# Altium schematic sheet RedBaron v2.SchDoc
size 1524 x 762 mm; SheetNumber: 1; SheetTotal: 1
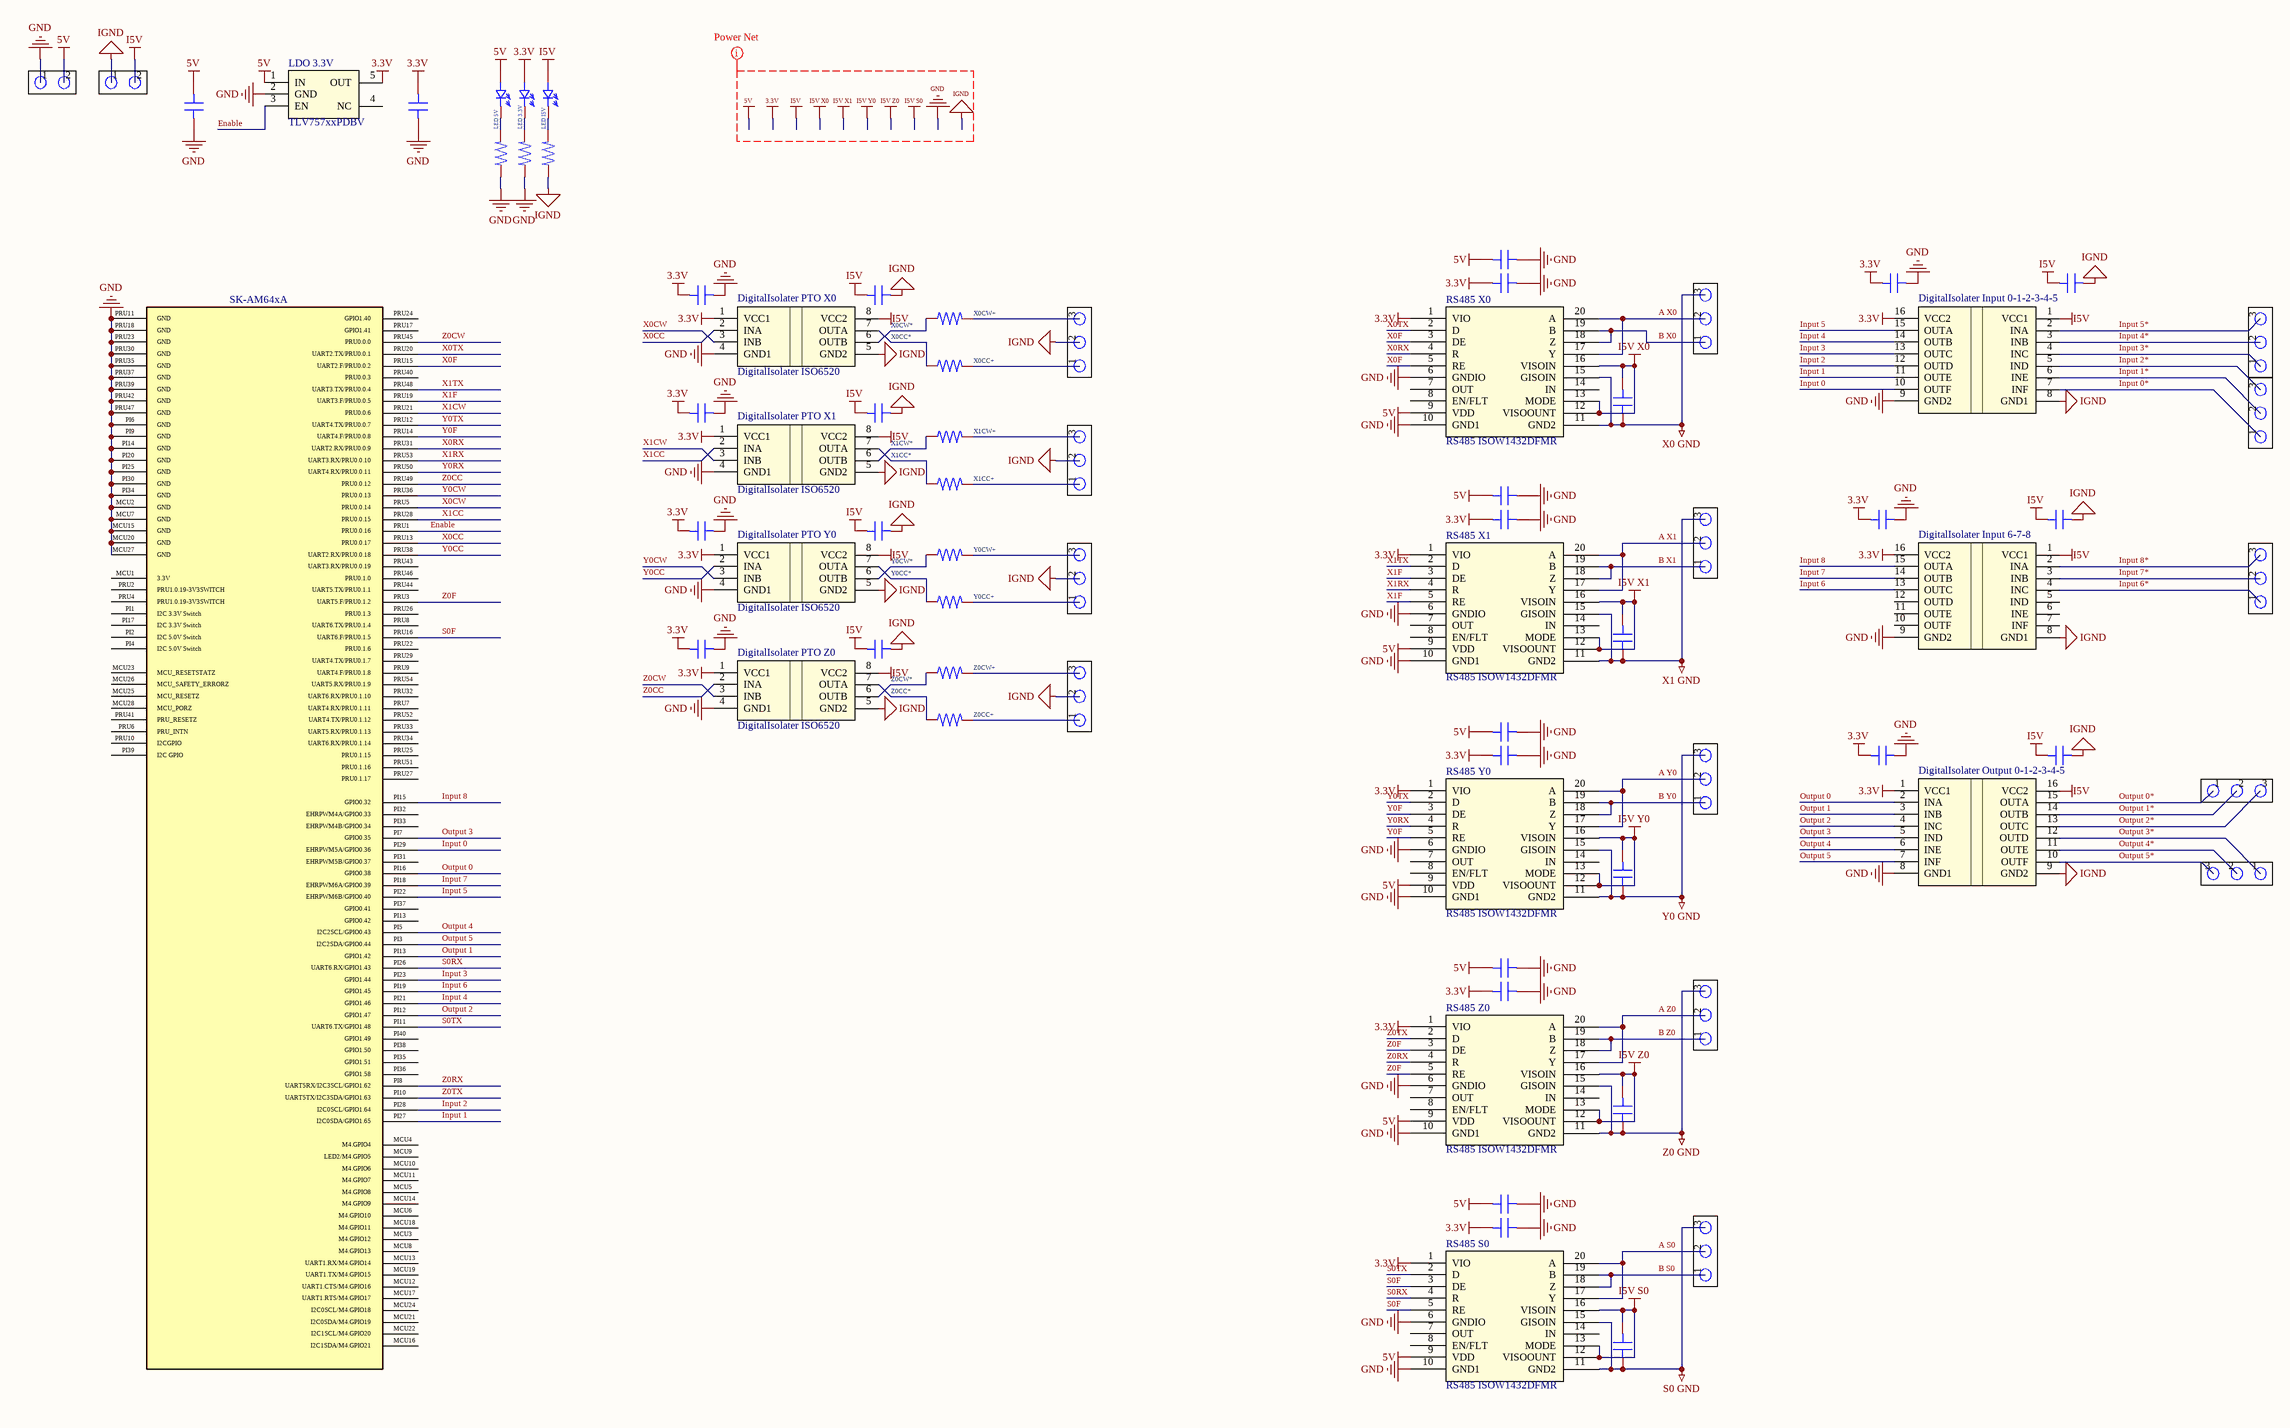
[diagram p0: RedBaron v2.SchDoc]

## Parts
C_Input_0-1-2-3-4-5_3.3V  1uF  [Capacitor 2012(0805)]  (value not drawn)
C_Input_0-1-2-3-4-5_I5V  1uF  [Capacitor 2012(0805)]  (value not drawn)
C_Input_6-7-8_3.3V  1uF  [Capacitor 2012(0805)]  (value not drawn)
C_Input_6-7-8_I5V  1uF  [Capacitor 2012(0805)]  (value not drawn)
C_LDO3.3V_IN  47uF  [Capacitor 2012(0805)]  (value not drawn)
C_LDO3.3V_OUT  47uF  [Capacitor 2012(0805)]  (value not drawn)
C_Output_0-1-2-3-4-5_3.3V  1uF  [Capacitor 2012(0805)]  (value not drawn)
C_Output_0-1-2-3-4-5_I5V  1uF  [Capacitor 2012(0805)]  (value not drawn)
C_PTO_X0_3.3V  1uF  [Capacitor 2012(0805)]  (value not drawn)
C_PTO_X0_I5V  1uF  [Capacitor 2012(0805)]  (value not drawn)
C_PTO_X1_3.3V  1uF  [Capacitor 2012(0805)]  (value not drawn)
C_PTO_X1_I5V  1uF  [Capacitor 2012(0805)]  (value not drawn)
C_PTO_Y0_3.3V  1uF  [Capacitor 2012(0805)]  (value not drawn)
C_PTO_Y0_I5V  1uF  [Capacitor 2012(0805)]  (value not drawn)
C_PTO_Z0_3.3V  1uF  [Capacitor 2012(0805)]  (value not drawn)
C_PTO_Z0_I5V  1uF  [Capacitor 2012(0805)]  (value not drawn)
C_RS485_C1_I5V  1uF  [Capacitor 2012(0805)]  (value not drawn)
C_RS485_S0_3.3V  1uF  [Capacitor 2012(0805)]  (value not drawn)
C_RS485_S0_5V  1uF  [Capacitor 2012(0805)]  (value not drawn)
C_RS485_S0_I5V  1uF  [Capacitor 2012(0805)]  (value not drawn)
C_RS485_X0_3.3V  1uF  [Capacitor 2012(0805)]  (value not drawn)
C_RS485_X0_5V  1uF  [Capacitor 2012(0805)]  (value not drawn)
C_RS485_X0_I5V  1uF  [Capacitor 2012(0805)]  (value not drawn)
C_RS485_X1_3.3V  1uF  [Capacitor 2012(0805)]  (value not drawn)
C_RS485_X1_5V  1uF  [Capacitor 2012(0805)]  (value not drawn)
C_RS485_Y0_3.3V  1uF  [Capacitor 2012(0805)]  (value not drawn)
C_RS485_Y0_5V  1uF  [Capacitor 2012(0805)]  (value not drawn)
C_RS485_Y0_I5V  1uF  [Capacitor 2012(0805)]  (value not drawn)
C_RS485_Z0_3.3V  1uF  [Capacitor 2012(0805)]  (value not drawn)
C_RS485_Z0_5V  1uF  [Capacitor 2012(0805)]  (value not drawn)
C_RS485_Z0_I5V  1uF  [Capacitor 2012(0805)]  (value not drawn)
Connector_DigitalPower  Connector Terminal Screw 5.08mm 2pin  [Terminal Screw 5.08mm 2pin]  (value not drawn)
Connector_Input_0-1-2  Connector Terminal Screw 5.08mm 3pin  [Terminal Screw 5.08mm 3pin]  (value not drawn)
Connector_Input_3-4-5  Connector Terminal Screw 5.08mm 3pin  [Terminal Screw 5.08mm 3pin]  (value not drawn)
Connector_Input_6-7-8  Connector Terminal Screw 5.08mm 3pin  [Terminal Screw 5.08mm 3pin]  (value not drawn)
Connector_IsolatedPower  Connector Terminal Screw 5.08mm 2pin  [Terminal Screw 5.08mm 2pin]  (value not drawn)
Connector_Output_0-1-2  Connector Terminal Screw 5.08mm 3pin  [Terminal Screw 5.08mm 3pin]  (value not drawn)
Connector_Output_3-4-5  Connector Terminal Screw 5.08mm 3pin  [Terminal Screw 5.08mm 3pin]  (value not drawn)
Connector_PTO_X0  Connector Terminal Screw 5.08mm 3pin  [Terminal Screw 5.08mm 3pin]  (value not drawn)
Connector_PTO_X1  Connector Terminal Screw 5.08mm 3pin  [Terminal Screw 5.08mm 3pin]  (value not drawn)
Connector_PTO_Y0  Connector Terminal Screw 5.08mm 3pin  [Terminal Screw 5.08mm 3pin]  (value not drawn)
Connector_PTO_Z0  Connector Terminal Screw 5.08mm 3pin  [Terminal Screw 5.08mm 3pin]  (value not drawn)
Connector_RS485_S0  Connector Terminal Screw 5.08mm 3pin  [Terminal Screw 5.08mm 3pin]  (value not drawn)
Connector_RS485_X0  Connector Terminal Screw 5.08mm 3pin  [Terminal Screw 5.08mm 3pin]  (value not drawn)
Connector_RS485_X1  Connector Terminal Screw 5.08mm 3pin  [Terminal Screw 5.08mm 3pin]  (value not drawn)
Connector_RS485_Y0  Connector Terminal Screw 5.08mm 3pin  [Terminal Screw 5.08mm 3pin]  (value not drawn)
Connector_RS485_Z0  Connector Terminal Screw 5.08mm 3pin  [Terminal Screw 5.08mm 3pin]  (value not drawn)
DevBoard  SK-AM64xA  [DevBoard SKAM64XA]
DigitalIsolater_Input_0-1-2-3-4-5  DigitalIsolater ISO7760  [ISO7760DBQ]  (value not drawn)
DigitalIsolater_Input_6-7-8  DigitalIsolater ISO7760  [ISO7760DBQ]  (value not drawn)
DigitalIsolater_Output_0-1-2-3-4-5  DigitalIsolater ISO7760  [ISO7760DBQ]  (value not drawn)
DigitalIsolater_PTO_X0  DigitalIsolater ISO6520  [ISO6520D]
DigitalIsolater_PTO_X1  DigitalIsolater ISO6520  [ISO6520D]
DigitalIsolater_PTO_Y0  DigitalIsolater ISO6520  [ISO6520D]
DigitalIsolater_PTO_Z0  DigitalIsolater ISO6520  [ISO6520D]
LDO_3.3V  TLV757xxPDBV  [TLV757xxPDBV]
LED_3.3V  LED  [LED 2012(0805)]  (value not drawn)
LED_5V  LED  [LED 2012(0805)]  (value not drawn)
LED_I5V  LED  [LED 2012(0805)]  (value not drawn)
R_LED_3.3V  150E  [Resistor 2012(0805)]  (value not drawn)
R_LED_5V  150E  [Resistor 2012(0805)]  (value not drawn)
R_LED_I5V  150E  [Resistor 2012(0805)]  (value not drawn)
R_X0CC  270E  [Resistor 2012(0805)]  (value not drawn)
R_X0CW  270E  [Resistor 2012(0805)]  (value not drawn)
R_X1CC  270E  [Resistor 2012(0805)]  (value not drawn)
R_X1CW  270E  [Resistor 2012(0805)]  (value not drawn)
R_Y0CC  270E  [Resistor 2012(0805)]  (value not drawn)
R_Y0CW  270E  [Resistor 2012(0805)]  (value not drawn)
R_Z0CC  270E  [Resistor 2012(0805)]  (value not drawn)
R_Z0CW  270E  [Resistor 2012(0805)]  (value not drawn)
RS485_S0  RS485 ISOW1432DFMR  [XISOW1432DFMR]
RS485_X0  RS485 ISOW1432DFMR  [XISOW1432DFMR]
RS485_X1  RS485 ISOW1432DFMR  [XISOW1432DFMR]
RS485_Y0  RS485 ISOW1432DFMR  [XISOW1432DFMR]
RS485_Z0  RS485 ISOW1432DFMR  [XISOW1432DFMR]

## Nets
3.3V: C_Input_0-1-2-3-4-5_3.3V.2 C_Input_6-7-8_3.3V.2 C_LDO3.3V_OUT.2 C_Output_0-1-2-3-4-5_3.3V.2 C_PTO_X0_3.3V.2 C_PTO_X1_3.3V.2 C_PTO_Y0_3.3V.2 C_PTO_Z0_3.3V.2 C_RS485_S0_3.3V.2 C_RS485_X0_3.3V.2 C_RS485_X1_3.3V.2 C_RS485_Y0_3.3V.2 C_RS485_Z0_3.3V.2 DigitalIsolater_Input_0-1-2-3-4-5.16(VCC2) DigitalIsolater_Input_6-7-8.16(VCC2) DigitalIsolater_Output_0-1-2-3-4-5.1(VCC1) DigitalIsolater_PTO_X0.1(VCC1) DigitalIsolater_PTO_X1.1(VCC1) DigitalIsolater_PTO_Y0.1(VCC1) DigitalIsolater_PTO_Z0.1(VCC1) LDO_3.3V.5(OUT) LED_3.3V.1 RS485_S0.1(VIO) RS485_X0.1(VIO) RS485_X1.1(VIO) RS485_Y0.1(VIO) RS485_Z0.1(VIO)
5V: C_LDO3.3V_IN.2 C_RS485_S0_5V.2 C_RS485_X0_5V.2 C_RS485_X1_5V.2 C_RS485_Y0_5V.2 C_RS485_Z0_5V.2 Connector_DigitalPower.2 LDO_3.3V.1(IN) LED_5V.1 RS485_S0.9(VDD) RS485_X0.9(VDD) RS485_X1.9(VDD) RS485_Y0.9(VDD) RS485_Z0.9(VDD)
GND: C_Input_0-1-2-3-4-5_3.3V.1 C_Input_6-7-8_3.3V.1 C_LDO3.3V_IN.1 C_LDO3.3V_OUT.1 C_Output_0-1-2-3-4-5_3.3V.1 C_PTO_X0_3.3V.1 C_PTO_X1_3.3V.1 C_PTO_Y0_3.3V.1 C_PTO_Z0_3.3V.1 C_RS485_S0_3.3V.1 C_RS485_S0_5V.1 C_RS485_X0_3.3V.1 C_RS485_X0_5V.1 C_RS485_X1_3.3V.1 C_RS485_X1_5V.1 C_RS485_Y0_3.3V.1 C_RS485_Y0_5V.1 C_RS485_Z0_3.3V.1 C_RS485_Z0_5V.1 Connector_DigitalPower.1 DevBoard.MCU2(GND) DevBoard.MCU7(GND) DevBoard.MCU15(GND) DevBoard.MCU20(GND) DevBoard.MCU27(GND) DevBoard.PI6(GND) DevBoard.PI9(GND) DevBoard.PI14(GND) DevBoard.PI20(GND) DevBoard.PI25(GND) DevBoard.PI30(GND) DevBoard.PI34(GND) DevBoard.PRU11(GND) DevBoard.PRU18(GND) DevBoard.PRU23(GND) DevBoard.PRU30(GND) DevBoard.PRU35(GND) DevBoard.PRU37(GND) DevBoard.PRU39(GND) DevBoard.PRU42(GND) DevBoard.PRU47(GND) DigitalIsolater_Input_0-1-2-3-4-5.9(GND2) DigitalIsolater_Input_6-7-8.9(GND2) DigitalIsolater_Output_0-1-2-3-4-5.8(GND1) DigitalIsolater_PTO_X0.4(GND1) DigitalIsolater_PTO_X1.4(GND1) DigitalIsolater_PTO_Y0.4(GND1) DigitalIsolater_PTO_Z0.4(GND1) LDO_3.3V.2(GND) R_LED_3.3V.1 R_LED_5V.1 RS485_S0.6(GNDIO) RS485_S0.10(GND1) RS485_X0.6(GNDIO) RS485_X0.10(GND1) RS485_X1.6(GNDIO) RS485_X1.10(GND1) RS485_Y0.6(GNDIO) RS485_Y0.10(GND1) RS485_Z0.6(GNDIO) RS485_Z0.10(GND1)
I5V: C_Input_0-1-2-3-4-5_I5V.2 C_Input_6-7-8_I5V.2 C_Output_0-1-2-3-4-5_I5V.2 C_PTO_X0_I5V.2 C_PTO_X1_I5V.2 C_PTO_Y0_I5V.2 C_PTO_Z0_I5V.2 Connector_IsolatedPower.2 DigitalIsolater_Input_0-1-2-3-4-5.1(VCC1) DigitalIsolater_Input_6-7-8.1(VCC1) DigitalIsolater_Output_0-1-2-3-4-5.16(VCC2) DigitalIsolater_PTO_X0.8(VCC2) DigitalIsolater_PTO_X1.8(VCC2) DigitalIsolater_PTO_Y0.8(VCC2) DigitalIsolater_PTO_Z0.8(VCC2) LED_I5V.1
I5V S0: C_RS485_S0_I5V.2 RS485_S0.12(VISOOUNT) RS485_S0.13(MODE) RS485_S0.16(VISOIN)
I5V X0: C_RS485_X0_I5V.2 RS485_X0.12(VISOOUNT) RS485_X0.13(MODE) RS485_X0.16(VISOIN)
I5V X1: C_RS485_C1_I5V.2 RS485_X1.12(VISOOUNT) RS485_X1.13(MODE) RS485_X1.16(VISOIN)
I5V Y0: C_RS485_Y0_I5V.2 RS485_Y0.12(VISOOUNT) RS485_Y0.13(MODE) RS485_Y0.16(VISOIN)
I5V Z0: C_RS485_Z0_I5V.2 RS485_Z0.12(VISOOUNT) RS485_Z0.13(MODE) RS485_Z0.16(VISOIN)
IGND: C_Input_0-1-2-3-4-5_I5V.1 C_Input_6-7-8_I5V.1 C_Output_0-1-2-3-4-5_I5V.1 C_PTO_X0_I5V.1 C_PTO_X1_I5V.1 C_PTO_Y0_I5V.1 C_PTO_Z0_I5V.1 Connector_IsolatedPower.1 Connector_PTO_X0.2 Connector_PTO_X1.2 Connector_PTO_Y0.2 Connector_PTO_Z0.2 DigitalIsolater_Input_0-1-2-3-4-5.8(GND1) DigitalIsolater_Input_6-7-8.8(GND1) DigitalIsolater_Output_0-1-2-3-4-5.9(GND2) DigitalIsolater_PTO_X0.5(GND2) DigitalIsolater_PTO_X1.5(GND2) DigitalIsolater_PTO_Y0.5(GND2) DigitalIsolater_PTO_Z0.5(GND2) R_LED_I5V.1
S0 GND: C_RS485_S0_I5V.1 Connector_RS485_S0.3 RS485_S0.11(GND2) RS485_S0.15(GISOIN)
X0 GND: C_RS485_X0_I5V.1 Connector_RS485_X0.3 RS485_X0.11(GND2) RS485_X0.15(GISOIN)
X1 GND: C_RS485_C1_I5V.1 Connector_RS485_X1.3 RS485_X1.11(GND2) RS485_X1.15(GISOIN)
Y0 GND: C_RS485_Y0_I5V.1 Connector_RS485_Y0.3 RS485_Y0.11(GND2) RS485_Y0.15(GISOIN)
Z0 GND: C_RS485_Z0_I5V.1 Connector_RS485_Z0.3 RS485_Z0.11(GND2) RS485_Z0.15(GISOIN)
A S0: Connector_RS485_S0.2 RS485_S0.17(Y) RS485_S0.20(A)
A X0: Connector_RS485_X0.2 RS485_X0.17(Y) RS485_X0.20(A)
A X1: Connector_RS485_X1.2 RS485_X1.17(Y) RS485_X1.20(A)
A Y0: Connector_RS485_Y0.2 RS485_Y0.17(Y) RS485_Y0.20(A)
A Z0: Connector_RS485_Z0.2 RS485_Z0.17(Y) RS485_Z0.20(A)
B S0: Connector_RS485_S0.1 RS485_S0.18(Z) RS485_S0.19(B)
B X0: Connector_RS485_X0.1 RS485_X0.18(Z) RS485_X0.19(B)
B X1: Connector_RS485_X1.1 RS485_X1.18(Z) RS485_X1.19(B)
B Y0: Connector_RS485_Y0.1 RS485_Y0.18(Z) RS485_Y0.19(B)
B Z0: Connector_RS485_Z0.1 RS485_Z0.18(Z) RS485_Z0.19(B)
Enable: DevBoard.PRU1(PRU0.0.16) LDO_3.3V.3(EN)
Input 0: DevBoard.PI29(EHRPWM5A/GPIO0.36) DigitalIsolater_Input_0-1-2-3-4-5.10(OUTF)
Input 0*: Connector_Input_0-1-2.1 DigitalIsolater_Input_0-1-2-3-4-5.7(INF)
Input 1: DevBoard.PI27(I2C0SDA/GPIO1.65) DigitalIsolater_Input_0-1-2-3-4-5.11(OUTE)
Input 1*: Connector_Input_0-1-2.2 DigitalIsolater_Input_0-1-2-3-4-5.6(INE)
Input 2: DevBoard.PI28(I2C0SCL/GPIO1.64) DigitalIsolater_Input_0-1-2-3-4-5.12(OUTD)
Input 2*: Connector_Input_0-1-2.3 DigitalIsolater_Input_0-1-2-3-4-5.5(IND)
Input 3: DevBoard.PI23(GPIO1.44) DigitalIsolater_Input_0-1-2-3-4-5.13(OUTC)
Input 3*: Connector_Input_3-4-5.1 DigitalIsolater_Input_0-1-2-3-4-5.4(INC)
Input 4: DevBoard.PI21(GPIO1.46) DigitalIsolater_Input_0-1-2-3-4-5.14(OUTB)
Input 4*: Connector_Input_3-4-5.2 DigitalIsolater_Input_0-1-2-3-4-5.3(INB)
Input 5: DevBoard.PI22(EHRPWM6B/GPIO0.40) DigitalIsolater_Input_0-1-2-3-4-5.15(OUTA)
Input 5*: Connector_Input_3-4-5.3 DigitalIsolater_Input_0-1-2-3-4-5.2(INA)
Input 6: DevBoard.PI19(GPIO1.45) DigitalIsolater_Input_6-7-8.13(OUTC)
Input 6*: Connector_Input_6-7-8.1 DigitalIsolater_Input_6-7-8.4(INC)
Input 7: DevBoard.PI18(EHRPWM6A/GPIO0.39) DigitalIsolater_Input_6-7-8.14(OUTB)
Input 7*: Connector_Input_6-7-8.2 DigitalIsolater_Input_6-7-8.3(INB)
Input 8: DevBoard.PI15(GPIO0.32) DigitalIsolater_Input_6-7-8.15(OUTA)
Input 8*: Connector_Input_6-7-8.3 DigitalIsolater_Input_6-7-8.2(INA)
LED 3.3V: LED_3.3V.2 R_LED_3.3V.2
LED 5V: LED_5V.2 R_LED_5V.2
LED I5V: LED_I5V.2 R_LED_I5V.2
Output 0: DevBoard.PI16(GPIO0.38) DigitalIsolater_Output_0-1-2-3-4-5.2(INA)
Output 0*: Connector_Output_0-1-2.1 DigitalIsolater_Output_0-1-2-3-4-5.15(OUTA)
Output 1: DevBoard.PI13(GPIO0.42) DigitalIsolater_Output_0-1-2-3-4-5.3(INB)
Output 1*: Connector_Output_0-1-2.2 DigitalIsolater_Output_0-1-2-3-4-5.14(OUTB)
Output 2: DevBoard.PI12(GPIO1.47) DigitalIsolater_Output_0-1-2-3-4-5.4(INC)
Output 2*: Connector_Output_0-1-2.3 DigitalIsolater_Output_0-1-2-3-4-5.13(OUTC)
Output 3: DevBoard.PI7(GPIO0.35) DigitalIsolater_Output_0-1-2-3-4-5.5(IND)
Output 3*: Connector_Output_3-4-5.1 DigitalIsolater_Output_0-1-2-3-4-5.12(OUTD)
Output 4: DevBoard.PI5(I2C2SCL/GPIO0.43) DigitalIsolater_Output_0-1-2-3-4-5.6(INE)
Output 4*: Connector_Output_3-4-5.2 DigitalIsolater_Output_0-1-2-3-4-5.11(OUTE)
Output 5: DevBoard.PI3(I2C2SDA/GPIO0.44) DigitalIsolater_Output_0-1-2-3-4-5.7(INF)
Output 5*: Connector_Output_3-4-5.3 DigitalIsolater_Output_0-1-2-3-4-5.10(OUTF)
S0F: DevBoard.PRU16(UART6.F/PRU0.1.5) RS485_S0.3(DE) RS485_S0.5(RE)
S0RX: DevBoard.PI26(UART6.RX/GPIO1.43) RS485_S0.4(R)
S0TX: DevBoard.PI11(UART6.TX/GPIO1.48) RS485_S0.2(D)
X0CC: DevBoard.PRU13(PRU0.0.17) DigitalIsolater_PTO_X0.2(INA)
X0CC*: DigitalIsolater_PTO_X0.7(OUTA) R_X0CC.1
X0CC+: Connector_PTO_X0.1 R_X0CC.2
X0CW: DevBoard.PRU5(PRU0.0.14) DigitalIsolater_PTO_X0.3(INB)
X0CW*: DigitalIsolater_PTO_X0.6(OUTB) R_X0CW.1
X0CW+: Connector_PTO_X0.3 R_X0CW.2
X0F: DevBoard.PRU15(UART2.F/PRU0.0.2) RS485_X0.3(DE) RS485_X0.5(RE)
X0RX: DevBoard.PRU31(UART2.RX/PRU0.0.9) RS485_X0.4(R)
X0TX: DevBoard.PRU20(UART2.TX/PRU0.0.1) RS485_X0.2(D)
X1CC: DevBoard.PRU28(PRU0.0.15) DigitalIsolater_PTO_X1.2(INA)
X1CC*: DigitalIsolater_PTO_X1.7(OUTA) R_X1CC.1
X1CC+: Connector_PTO_X1.1 R_X1CC.2
X1CW: DevBoard.PRU21(PRU0.0.6) DigitalIsolater_PTO_X1.3(INB)
X1CW*: DigitalIsolater_PTO_X1.6(OUTB) R_X1CW.1
X1CW+: Connector_PTO_X1.3 R_X1CW.2
X1F: DevBoard.PRU19(UART3.F/PRU0.0.5) RS485_X1.3(DE) RS485_X1.5(RE)
X1RX: DevBoard.PRU53(UART3.RX/PRU0.0.10) RS485_X1.4(R)
X1TX: DevBoard.PRU48(UART3.TX/PRU0.0.4) RS485_X1.2(D)
Y0CC: DevBoard.PRU38(UART2.RX/PRU0.0.18) DigitalIsolater_PTO_Y0.2(INA)
Y0CC*: DigitalIsolater_PTO_Y0.7(OUTA) R_Y0CC.1
Y0CC+: Connector_PTO_Y0.1 R_Y0CC.2
Y0CW: DevBoard.PRU36(PRU0.0.13) DigitalIsolater_PTO_Y0.3(INB)
Y0CW*: DigitalIsolater_PTO_Y0.6(OUTB) R_Y0CW.1
Y0CW+: Connector_PTO_Y0.3 R_Y0CW.2
Y0F: DevBoard.PRU14(UART4.F/PRU0.0.8) RS485_Y0.3(DE) RS485_Y0.5(RE)
Y0RX: DevBoard.PRU50(UART4.RX/PRU0.0.11) RS485_Y0.4(R)
Y0TX: DevBoard.PRU12(UART4.TX/PRU0.0.7) RS485_Y0.2(D)
Z0CC: DevBoard.PRU49(PRU0.0.12) DigitalIsolater_PTO_Z0.2(INA)
Z0CC*: DigitalIsolater_PTO_Z0.7(OUTA) R_Z0CC.1
Z0CC+: Connector_PTO_Z0.1 R_Z0CC.2
Z0CW: DevBoard.PRU45(PRU0.0.0) DigitalIsolater_PTO_Z0.3(INB)
Z0CW*: DigitalIsolater_PTO_Z0.6(OUTB) R_Z0CW.1
Z0CW+: Connector_PTO_Z0.3 R_Z0CW.2
Z0F: DevBoard.PRU3(UART5.F/PRU0.1.2) RS485_Z0.3(DE) RS485_Z0.5(RE)
Z0RX: DevBoard.PI8(UART5RX/I2C3SCL/GPIO1.62) RS485_Z0.4(R)
Z0TX: DevBoard.PI10(UART5TX/I2C3SDA/GPIO1.63) RS485_Z0.2(D)

Not connected (* = marked no-connect by the designer): DevBoard MCU1(3.3V) MCU3(M4.GPIO12) MCU4(M4.GPIO4) MCU5(M4.GPIO8) MCU6(M4.GPIO10) MCU8(M4.GPIO13) MCU9(LED2/M4.GPIO5) MCU10(M4.GPIO6) MCU11(M4.GPIO7) MCU12(UART1.CTS/M4.GPIO16) MCU13(UART1.RX/M4.GPIO14) MCU14(M4.GPIO9) MCU16(I2C1SDA/M4.GPIO21) MCU17(UART1.RTS/M4.GPIO17) MCU18(M4.GPIO11) MCU19(UART1.TX/M4.GPIO15) MCU21(I2C0SDA/M4.GPIO19) MCU22(I2C1SCL/M4.GPIO20) MCU23(MCU_RESETSTATZ) MCU24(I2C0SCL/M4.GPIO18) MCU25(MCU_RESETZ) MCU26(MCU_SAFETY_ERRORZ) MCU28(MCU_PORZ) PI1(I2C_3.3V_Switch) PI2(I2C_5.0V_Switch) PI4(I2C_5.0V_Switch) PI17(I2C_3.3V_Switch) PI31(EHRPWM5B/GPIO0.37) PI32(EHRPWM4A/GPIO0.33) PI33(EHRPWM4B/GPIO0.34) PI35(GPIO1.51) PI36(GPIO1.58) PI37(GPIO0.41) PI38(GPIO1.50) PI39(I2C_GPIO) PI40(GPIO1.49) PRU2(PRU1.0.19-3V3SWITCH) PRU4(PRU1.0.19-3V3SWITCH) PRU6(PRU_INTN) PRU7(UART4.RX/PRU0.1.11) PRU8(UART6.TX/PRU0.1.4) PRU9(UART4.F/PRU0.1.8) PRU10(I2CGPIO) PRU17(GPIO1.41) PRU22(PRU0.1.6) PRU24(GPIO1.40) PRU25(PRU0.1.15) PRU26(PRU0.1.3) PRU27(PRU0.1.17) PRU29(UART4.TX/PRU0.1.7) PRU32(UART6.RX/PRU0.1.10) PRU33(UART5.RX/PRU0.1.13) PRU34(UART6.RX/PRU0.1.14) PRU40(PRU0.0.3) PRU41(PRU_RESETZ) PRU43(UART3.RX/PRU0.0.19) PRU44(UART5.TX/PRU0.1.1) PRU46(PRU0.1.0) PRU51(PRU0.1.16) PRU52(UART4.TX/PRU0.1.12) PRU54(UART5.RX/PRU0.1.9); DigitalIsolater_Input_6-7-8 5(IND) 6(INE) 7(INF) 10(OUTF) 11(OUTE) 12(OUTD); LDO_3.3V 4(NC); RS485_S0 7(OUT) 8(EN/FLT) 14(IN); RS485_X0 7(OUT) 8(EN/FLT) 14(IN); RS485_X1 7(OUT) 8(EN/FLT) 14(IN); RS485_Y0 7(OUT) 8(EN/FLT) 14(IN); RS485_Z0 7(OUT) 8(EN/FLT) 14(IN)

## Layout directives
net class Power: 3.3V, 5V, GND, I5V, I5V S0, I5V X0, I5V X1, I5V Y0, I5V Z0, IGND

## Library data of the parts
C_Input_0-1-2-3-4-5_3.3V C_Input_0-1-2-3-4-5_I5V C_Input_6-7-8_3.3V C_Input_6-7-8_I5V C_LDO3.3V_IN C_LDO3.3V_OUT C_Output_0-1-2-3-4-5_3.3V C_Output_0-1-2-3-4-5_I5V C_PTO_X0_3.3V C_PTO_X0_I5V C_PTO_X1_3.3V C_PTO_X1_I5V C_PTO_Y0_3.3V C_PTO_Y0_I5V C_PTO_Z0_3.3V C_PTO_Z0_I5V C_RS485_C1_I5V C_RS485_S0_3.3V C_RS485_S0_5V C_RS485_S0_I5V C_RS485_X0_3.3V C_RS485_X0_5V C_RS485_X0_I5V C_RS485_X1_3.3V C_RS485_X1_5V C_RS485_Y0_3.3V C_RS485_Y0_5V C_RS485_Y0_I5V C_RS485_Z0_3.3V C_RS485_Z0_5V C_RS485_Z0_I5V = Capacitor
Connector_DigitalPower Connector_IsolatedPower = Connector Terminal Screw 5.08mm 2pin: Terminal Screw 5.08mm; GateName_1: G$1; SymbolName_1: TERMINALBLOCK1X2; DeviceSetName: TERMINALBLOCK-1X2; LibraryName: TOTUDU; Package: SCREWTERMINAL1X2
Connector_Input_0-1-2 Connector_Input_3-4-5 Connector_Input_6-7-8 Connector_Output_0-1-2 Connector_Output_3-4-5 Connector_PTO_X0 Connector_PTO_X1 Connector_PTO_Y0 Connector_PTO_Z0 Connector_RS485_S0 Connector_RS485_X0 Connector_RS485_X1 Connector_RS485_Y0 Connector_RS485_Z0 = Connector Terminal Screw 5.08mm 3pin: Terminal Screw 5.08mm; GateName_1: G$1; SymbolName_1: TERMINALBLOCK1X2; DeviceSetName: TERMINALBLOCK-1X2; LibraryName: TOTUDU; Package: SCREWTERMINAL1X2
DevBoard = DevBoard SK-AM64xA
DigitalIsolater_Input_0-1-2-3-4-5 DigitalIsolater_Input_6-7-8 DigitalIsolater_Output_0-1-2-3-4-5 = DigitalIsolater ISO7760: 6 Channel Digital Isolator; Manufacturer_Name: Texas Instruments; TYPE: TYPE; RefDes: RefDes; Copyright: Copyright (C) 2025 Ultra Librarian. All rights reserved.; Manufacturer_Part_Number: ISO7760DBQ; Datasheet: https://www.ti.com/lit/gpn/iso7760
DigitalIsolater_PTO_X0 DigitalIsolater_PTO_X1 DigitalIsolater_PTO_Y0 DigitalIsolater_PTO_Z0 = DigitalIsolater ISO6520: 2 Channel Digital Isolator; Datasheet: https://www.ti.com/lit/gpn/iso7760; Price: Rs. 114
LDO_3.3V = LDO TLV757xxPDBV: LDO 1A; Manufacturer_Name: Texas Instruments; Manufacturer_Part_Number: TLV75709PDRVR; Datasheet: https://www.ti.com/lit/gpn/tlv757p; Price: Rs. 34
R_LED_3.3V R_LED_5V R_LED_I5V R_X0CC R_X0CW R_X1CC R_X1CW R_Y0CC R_Y0CW R_Z0CC R_Z0CW = Resistor
RS485_S0 RS485_X0 RS485_X1 RS485_Y0 RS485_Z0 = RS485 ISOW1432DFMR: Isolated RS485 With Integrated Isolated Power; Manufacturer_Name: Texas Instruments; Copyright: Copyright (C) 2025 Ultra Librarian. All rights reserved.; Manufacturer_Part_Number: XISOW1432DFMR; Datasheet: https://www.ti.com/lit/gpn/isow1432; RefDes: RefDes; Type: Type